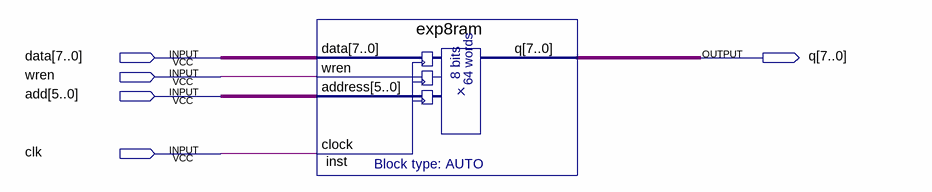
[diagram p0: schematic sheet]
// Quartus schematic exp8.bdf as structural Verilog: 1 symbols, 5 pins
module exp8 (
  input  [7:0] data,
  input  wren,
  input  [5:0] add,
  input  clk,
  output [7:0] q
);

  exp8ram inst (.data(data), .wren(wren), .address(add), .clock(clk), .q(q));
endmodule
